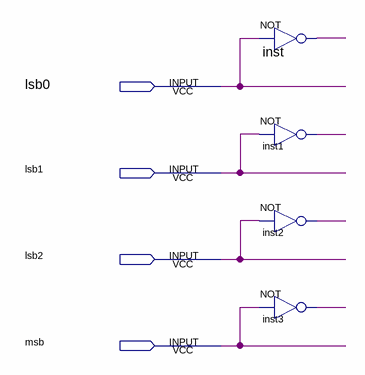
[diagram p0: schematic sheet]
// Quartus schematic state_output.bdf as structural Verilog: 4 symbols, 4 pins
module state_output (
  input  lsb0,
  input  lsb1,
  input  lsb2,
  input  msb
);

  wire inst1_out, inst2_out, inst3_out, inst_out;

  not inst (inst_out, lsb0);
  not inst1 (inst1_out, lsb1);
  not inst2 (inst2_out, lsb2);
  not inst3 (inst3_out, msb);
endmodule
